# Altium schematic sheet cd_interface.SchDoc
size A4
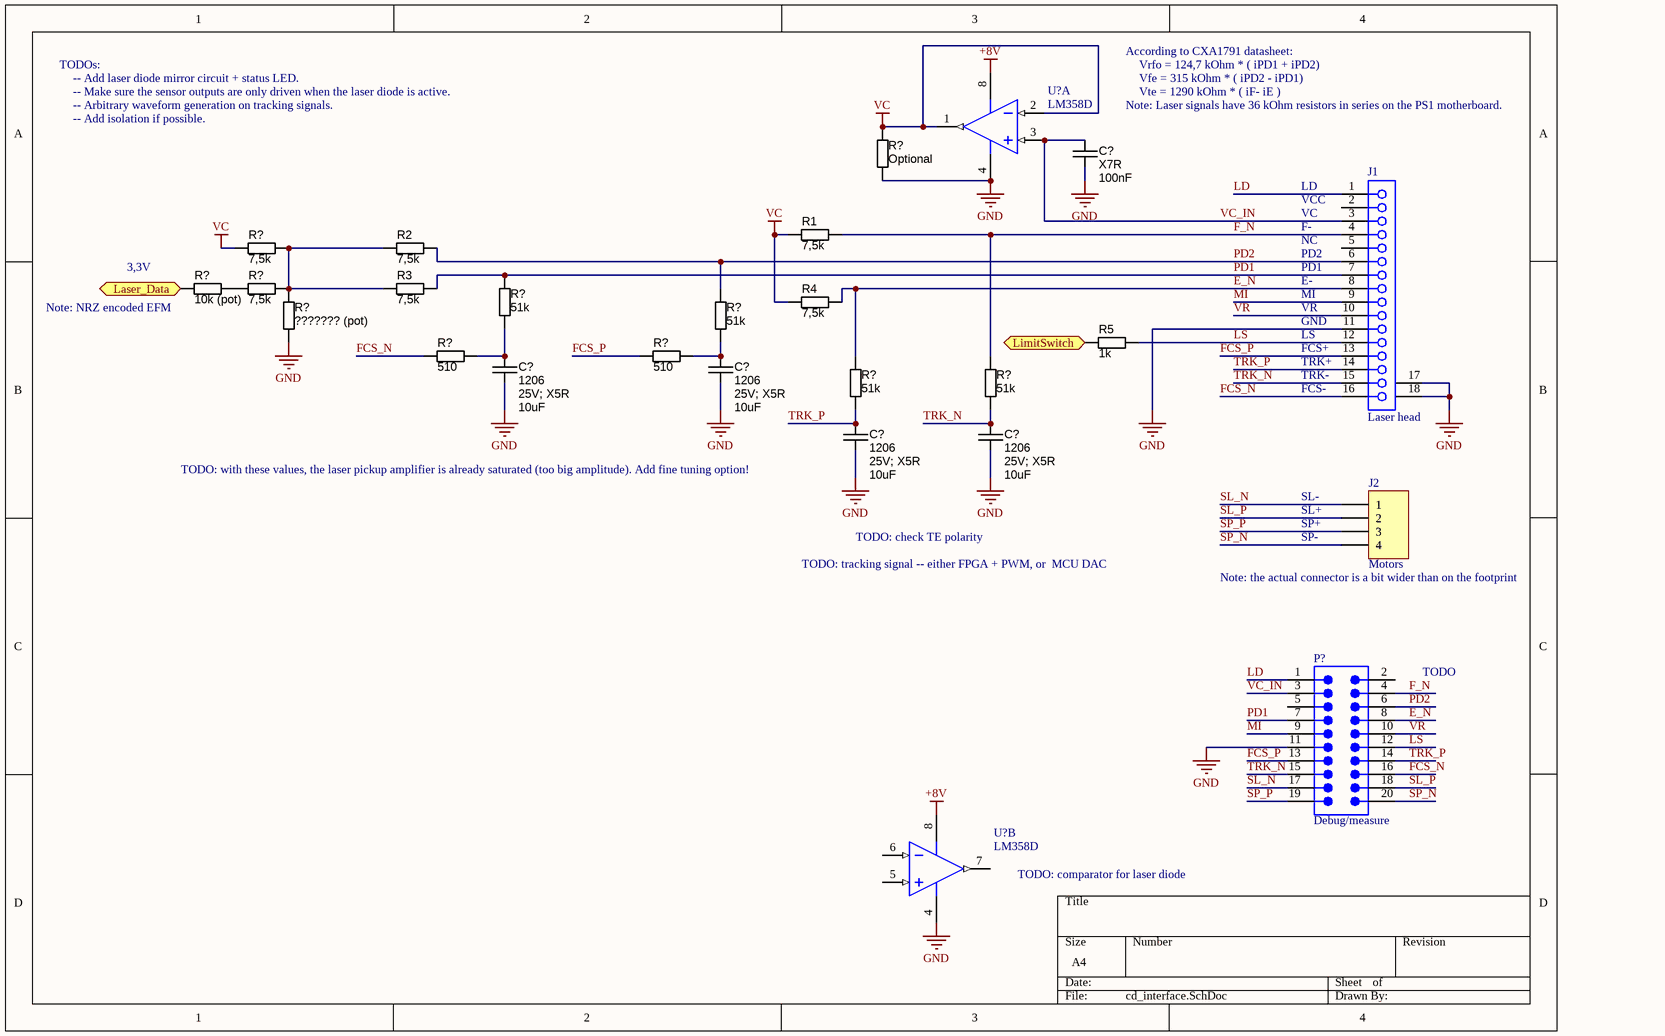
[diagram p0: cd_interface.SchDoc]

## Parts
(Parts that share a designator on the sheet are numbered #1, #2 ... from top to bottom, then left to right.)
C?#1  value 100nF  Temperature Coefficient: X7R  [CAPC2012X135N]  (hidden comment: 0805)
C?#2  value 10uF  Package / Case: 1206  Ratings: 25V; X5R  [CAPC3216X180N]  (hidden comment: approved sub OK)
C?#3  value 10uF  Package / Case: 1206  Ratings: 25V; X5R  [CAPC3216X180N]  (hidden comment: approved sub OK)
C?#4  value 10uF  Package / Case: 1206  Ratings: 25V; X5R  [CAPC3216X180N]  (hidden comment: approved sub OK)
C?#5  value 10uF  Package / Case: 1206  Ratings: 25V; X5R  [CAPC3216X180N]  (hidden comment: approved sub OK)
J1  Laser head  [FPC16_1mm_top]
J2  Motors  [64800411622]
P?  Debug/measure  [918520x329]
R1  value 7,5k  [RESC2012N_ZERO]  (hidden comment: 0805)
R2  value 7,5k  [RESC2012N_ZERO]  (hidden comment: 0805)
R3  value 7,5k  [RESC2012N_ZERO]  (hidden comment: 0805)
R4  value 7,5k  [RESC2012N_ZERO]  (hidden comment: 0805)
R5  value 1k  [RESC2012N_ZERO]  (hidden comment: 0805)
R?#1  value Optional  [RESC2012N_ZERO]  (hidden comment: 0805)
R?#2  value 7,5k  [RESC2012N_ZERO]  (hidden comment: 0805)
R?#3  value 10k (pot)  [RESC2012N_ZERO]  (hidden comment: 0805)
R?#4  value 7,5k  [RESC2012N_ZERO]  (hidden comment: 0805)
R?#5  value 51k  [RESC2012N_ZERO]  (hidden comment: 0805)
R?#6  value ??????? (pot)  [RESC2012N_ZERO]  (hidden comment: 0805)
R?#7  value 51k  [RESC2012N_ZERO]  (hidden comment: 0805)
R?#8  value 510  [RESC2012N_ZERO]  (hidden comment: 0805)
R?#9  value 510  [RESC2012N_ZERO]  (hidden comment: 0805)
R?#10  value 51k  [RESC2012N_ZERO]  (hidden comment: 0805)
R?#11  value 51k  [RESC2012N_ZERO]  (hidden comment: 0805)
U?#1  LM358D  [751-07_M]  (part A of 2)
U?#2  LM358D  [751-07_M]  (part B of 2)

## Ports
Laser_Data (in), LimitSwitch (in)

## Nets
+8V: U?#1.8(V+) U?#2.8(V+)
GND: C?#1.2 C?#2.1 C?#3.1 C?#4.1 C?#5.1 J1.11 J1.17(MH1) J1.18(MH2) P?.11 R?#1.1 R?#6.1 U?#1.4(V-) U?#2.4(V-)
VC: R1.1 R4.1 R?#1.2 R?#2.1 U?#1.1(OUT) U?#1.2(IN-)
E_N: J1.8 P?.8 R4.2 R?#10.2
F_N: J1.4 P?.4 R1.2 R?#11.2
FCS_N: J1.16 P?.16 R?#8.1
FCS_P: J1.13 P?.13 R?#9.1
Laser_Data: R?#3.1 ; port Laser_Data
LD: J1.1 P?.1
LimitSwitch: R5.1 ; port LimitSwitch
LS: J1.12 P?.12 R5.2
MI: J1.9 P?.9
PD1: J1.7 P?.7 R3.2 R?#5.2
PD2: J1.6 P?.6 R2.2 R?#7.2
SL_N: J2.1 P?.17
SL_P: J2.2 P?.18
SP_N: J2.4 P?.20
SP_P: J2.3 P?.19
TRK_N: C?#5.2 J1.15 P?.15 R?#11.1
TRK_P: C?#4.2 J1.14 P?.14 R?#10.1
VC_IN: C?#1.1 J1.3 P?.3 U?#1.3(IN+)
VR: J1.10 P?.10
NetC?#2_2: C?#2.2 R?#5.1 R?#8.2
NetC?#3_2: C?#3.2 R?#7.1 R?#9.2
NetR2_1: R2.1 R3.1 R?#2.2 R?#4.2 R?#6.2
NetR?#3_2: R?#3.2 R?#4.1

Not connected (* = marked no-connect by the designer): J1 2 5; P? 2 5; U?#2 5(IN+) 6(IN-) 7(OUT)

## Notes on the sheet
- TODOs:
- -- Add laser diode mirror circuit + status LED.
- -- Make sure the sensor outputs are only driven when the laser diode is active.
- -- Arbitrary waveform generation on tracking signals.
- According to CXA1791 datasheet:
- Note: Laser signals have 36 kOhm resistors in series on the PS1 motherboard.
- Vrfo = 124,7 kOhm * ( iPD1 + iPD2)
- Vfe = 315 kOhm * ( iPD2 - iPD1)
- Vte = 1290 kOhm * ( iF- iE )
- -- Add isolation if possible.
- LD
- (near J1) VCC
- VC
- F-
- NC
- (near R?#3) Note: NRZ encoded EFM
- (near R?#3) 3,3V
- (near J1) PD2
- (near J1) PD1
- E-
- MI
- VR
- (near J1) GND
- LS
- (near J1) FCS+
- (near J1) TRK+
- (near J1) TRK-
- (near J1) FCS-
- (near C?#4) TODO: with these values, the laser pickup amplifier is already saturated (too big amplitude). Add fine tuning option!
- (near J2) SL-
- (near J2) SL+
- TODO: tracking signal -- either FPGA + PWM, or  MCU DAC
- TODO: check TE polarity
- (near J2) Note: the actual connector is a bit wider than on the footprint
- (near J2) SP+
- (near J2) SP-
- TODO
- TODO: comparator for laser diode

## Library data of the parts
C?#1 = CAPC_1u_0805_X7R_16V_10%: Capacitor SMD Cer X7R 0805; Tolerance: ±10%; Ratings: 16V; X7R; Material: ceramic; SCDType: spec; Package / Case: 0805 (2012 metric)
C?#2-C?#5 = CAPC_10u_1206_16V: Capacitor SMD Cer 10uF 10% 16V X7R 1206; Manufacturer 1: Kemet; Manufacturer Part Number 1: C1206C106K4RACTU; Material: ceramic; SCDType: spec; Tolerance: ±10%; Supplier 1: Digi-Key; Supplier Part Number 1: 399-3525-1-ND
J1 = CL586-0536-8: FH12 Series, "Flip-Lock" SMT/ZIF FFC/FPC Connector - 1.0mm Spaced Bottom Standard Contact; Positions: 16; ContactMaterial: Phosphor Bronze; Current: 0.5A; PCB_Layout: Complies with manufacturer's recommendation.; Note: Pad dimensions follow nominal values, Suitable for Wave Soldering, Adjust for Re-flow.; Published: 17-Jul-2002; DatasheetVersion: 13-Nov-2000; PackageVersion: 13-Nov-2000; PackageReference: FH12-16S-1SH; Publisher: Altium Limited; ComponentLink1Description: Manufacturer Link; ComponentLink1URL: http://www.hiroseusa.com/; ComponentLink2Description: Datasheet; ComponentLink2URL: http://www.hirose.co.jp/cataloge_hp/e58605370.pdf
J2 = WE-1.50mm Pitch 64800411622: WR-WTB 1.50mm Male Shrouded Header; Manufacturer: W¨¹rth Elektronik eiSos GmbH; ComponentLink1 Description: Manufacturer; ComponentLink2 Description: Datasheet; NoPins: 4; Created Date: 11 June 2013; partNo: 64800411622; ComponentLink1URL: http://www.we-online.com; ComponentLink2URL: http://katalog.we-online.de/em/datasheet/6480xx11622.pdf; Created by: Karrer Zheng
P? = 09 18 520 6329: Flat Cable Connector (IDC), Standard Male Header, Straight Press-in Pin, 20 Contacts, Performance Level 2; PCB_Layout: Complies with manufacturer's recommendation.; DrillSize: Corresponds to nominal value.; Published: 15-Nov-2004; PackageDocument: Feb-2000; PackageReference: 918520x329; Publisher: Altium Limited; ComponentLink1Description: Manufacturer Link; ComponentLink1URL: http://www.harting.com/; ComponentLink2Description: Packaging Specification; ComponentLink2URL: http://www.harkis.harting.com/_sek/pdf/TB_0918520x329_BL01_R32154.pdf
R1-R5 R?#1-R?#11 = RES_0R_0805: Resistor SMD chip 0.0 Ohm 0.125W 0805; Manufacturer 1: Samsung Electro-Mechanics America, Inc; Manufacturer Part Number 1: RC2012J000CS; Ratings: 1/8W; SCDType: spec; Tolerance: N/A; Package / Case: 0805 (2012 metric); Supplier 1: Digi-Key; Supplier Part Number 1: 1276-5466-6-ND; RoHS 1: RoHS Compliant; ComponentLink1URL: http://www.samsungsem.com/servlet/FileDownload?filename=productcatalog/pdf/Chip_Resistor.pdf; ComponentLink1Description: http://www.samsungsem.com/servlet/FileDownload?filename=productcatalog/pdf/Chip_Resistor.pdf; Supplier 2: Digi-Key; Supplier Part Number 2: RMCF0805ZT0R00DKR-ND; Manufacturer 2: Stackpole Electronics Inc; Manufacturer Part Number 2: RMCF0805ZT0R00; RoHS 2: RoHS Compliant; ComponentLink2URL: http://www.seielect.com/Catalog/SEI-RMCF_RMCP.pdf; ComponentLink2Description: http://www.seielect.com/Catalog/SEI-RMCF_RMCP.pdf; Supplier 3: Digi-Key; Supplier Part Number 3: 311-0.0ARDKR-ND; Manufacturer 3: Yageo; Manufacturer Part Number 3: RC0805JR-070RL; RoHS 3: RoHS Compliant; ComponentLink3URL: http://media.digikey.com/pdf/Data%20Sheets/Yageo%20PDFs/RC0805%20Pb%20Free.pdf; ComponentLink3Description: http://media.digikey.com/pdf/Data%20Sheets/Yageo%20PDFs/RC0805%20Pb%20Free.pdf; Supplier 4: Digi-Key; Supplier Part Number 4: P0.0ADKR-ND; Manufacturer 4: Panasonic Electronic Components; Manufacturer Part Number 4: ERJ-6GEY0R00V; RoHS 4: RoHS Compliant; ComponentLink4URL: http://industrial.panasonic.com/www-cgi/jvcr13pz.cgi?E+PZ+3+AOA0001+ERJ6GEY0R00V+7+WW; ComponentLink4Description: http://industrial.panasonic.com/www-cgi/jvcr13pz.cgi?E+PZ+3+AOA0001+ERJ6GEY0R00V+7+WW; Supplier 5: Digi-Key; Supplier Part Number 5: RHM0.0CPDKR-ND; Manufacturer 5: Rohm Semiconductor; Manufacturer Part Number 5: MCR10ERTJ000; RoHS 5: RoHS Compliant; ComponentLink5URL: http://rohmfs.rohm.com/en/products/databook/datasheet/passive/resistor/chip_resistor/mcr_g.pdf; ComponentLink5Description: http://rohmfs.rohm.com/en/products/databook/datasheet/passive/resistor/chip_resistor/mcr_g.pdf
U?#1 U?#2 = LM358D: Single-Supply Dual Operational Amplifier; Published: 28-Feb-2003; LatestRevisionDate: 13-Apr-2006; LatestRevisionNote: IPC-7351 Footprint Added.; DatasheetVersion: Jan-2002, Rev. 7; PackageVersion: rev7, Jan-2002; PackageReference: 751-07; Publisher: Altium Limited; PackageDescription: 8-Pin Plastic Small Outline Integrated Circuit 1.27 mm Pitch; Code_JEDEC: MS-012-AA; Code_IPC: SOIC127P600-8; ComponentLink1Description: Manufacturer Link; ComponentLink1URL: http://www.onsemi.com/; ComponentLink2Description: Datasheet; ComponentLink2URL: http://www.onsemi.com/pub/Collateral/LM358-D.PDF